# EAGLE schematic Pinduino-Nano-Sys11-adaptor-panalized_2-AR (EAGLE 7.2.0)
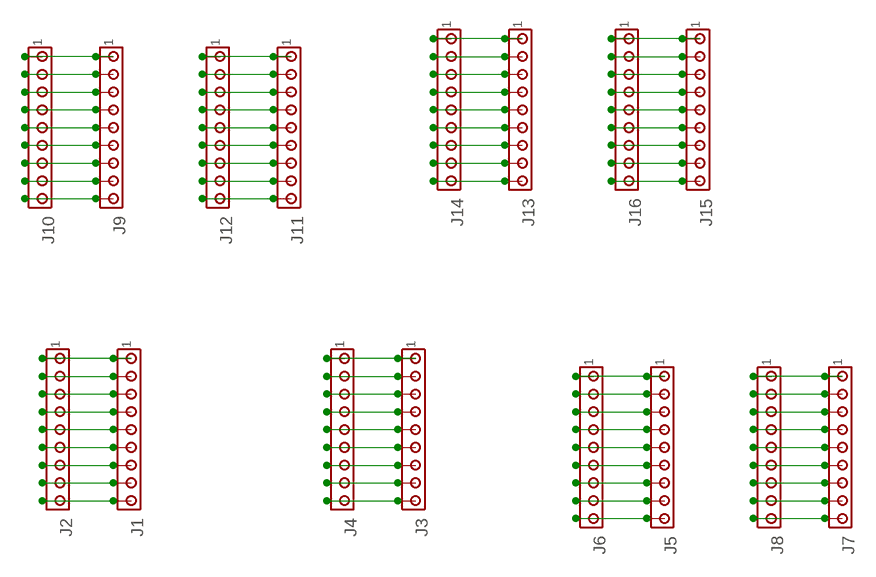
[diagram p0: schematic, sheet 1]

## Parts
J1  MTA09-156  [1X9MTA]
J2  MTA09-156  [1X9MTA]
J3  MTA09-156  [1X9MTA]
J4  MTA09-156  [1X9MTA]
J5  MTA09-156  [1X9MTA]
J6  MTA09-156  [1X9MTA]
J7  MTA09-156  [1X9MTA]
J8  MTA09-156  [1X9MTA]
J9  MTA09-156  [1X9MTA]
J10  MTA09-156  [1X9MTA]
J11  MTA09-156  [1X9MTA]
J12  MTA09-156  [1X9MTA]
J13  MTA09-156  [1X9MTA]
J14  MTA09-156  [1X9MTA]
J15  MTA09-156  [1X9MTA]
J16  MTA09-156  [1X9MTA]

## Nets
N$1: J9.1 J10.1
N$2: J9.2 J10.2
N$3: J9.3 J10.3
N$4: J9.4 J10.4
N$5: J9.5 J10.5
N$6: J9.7 J10.7
N$7: J9.8 J10.8
N$8: J9.9 J10.9
N$9: J11.1 J12.1
N$10: J11.2 J12.2
N$11: J11.3 J12.3
N$12: J11.4 J12.4
N$13: J11.5 J12.5
N$14: J11.7 J12.7
N$15: J11.8 J12.8
N$16: J11.9 J12.9
N$17: J13.1 J14.1
N$18: J13.2 J14.2
N$19: J13.3 J14.3
N$20: J13.4 J14.4
N$21: J13.5 J14.5
N$22: J13.7 J14.7
N$23: J13.8 J14.8
N$24: J13.9 J14.9
N$25: J15.1 J16.1
N$26: J15.2 J16.2
N$27: J15.3 J16.3
N$28: J15.4 J16.4
N$29: J15.5 J16.5
N$30: J15.7 J16.7
N$31: J15.8 J16.8
N$32: J15.9 J16.9
N$33: J1.6 J2.6
N$34: J1.1 J2.1
N$35: J1.2 J2.2
N$36: J1.3 J2.3
N$37: J1.4 J2.4
N$38: J1.5 J2.5
N$39: J9.6 J10.6
N$40: J1.7 J2.7
N$41: J1.8 J2.8
N$42: J1.9 J2.9
N$43: J3.1 J4.1
N$44: J3.2 J4.2
N$45: J3.3 J4.3
N$46: J3.4 J4.4
N$47: J11.6 J12.6
N$48: J13.6 J14.6
N$49: J15.6 J16.6
N$63: J3.5 J4.5
N$67: J3.6 J4.6
N$68: J3.7 J4.7
N$69: J3.8 J4.8
N$70: J3.9 J4.9
N$71: J5.1 J6.1
N$72: J5.2 J6.2
N$73: J5.3 J6.3
N$74: J5.4 J6.4
N$75: J5.5 J6.5
N$76: J5.6 J6.6
N$77: J5.7 J6.7
N$78: J5.8 J6.8
N$79: J5.9 J6.9
N$80: J7.1 J8.1
N$81: J7.2 J8.2
N$82: J7.3 J8.3
N$83: J7.4 J8.4
N$84: J7.5 J8.5
N$85: J7.6 J8.6
N$86: J7.7 J8.7
N$87: J7.8 J8.8
N$88: J7.9 J8.9

## Library data of the parts
J1-J16 = con-amp:MTA09-156: AMP connector

## Net classes
0 default: width 0.406 mm
1 Power: width 0.61 mm
2 GND: width 0.61 mm